# EAGLE design V2 (EAGLE 9.3.0)
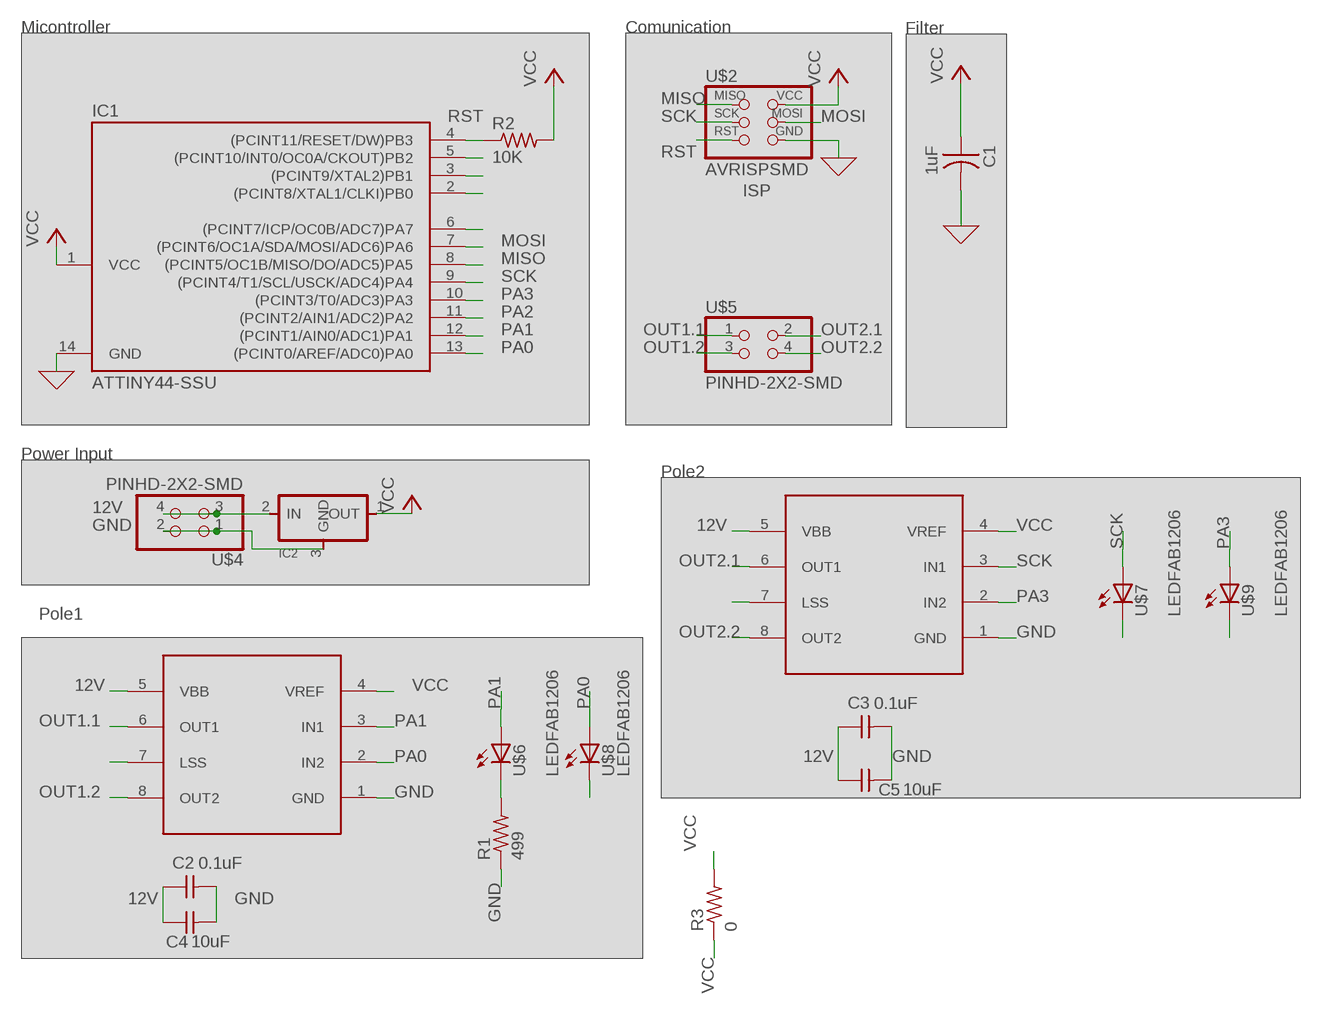
[diagram p0: schematic, sheet 1]

## Parts
C1  1uF  CAP-US1206FAB  [C1206FAB]
C2  0.1uF  CAP-UNPOLARIZEDFAB  [C1206FAB]
C3  0.1uF  CAP-UNPOLARIZEDFAB  [C1206FAB]
C4  10uF  CAP-UNPOLARIZEDFAB  [C1206FAB]
C5  10uF  CAP-UNPOLARIZEDFAB  [C1206FAB]
IC1  ATTINY44-SSU  [SOIC14]
IC2  REGULATORSOT23  [SOT23]
R1  499  RES-US1206FAB  [R1206FAB]
R2  10K  RES-US1206FAB  [R1206FAB]
R3  0  RES-US1206FAB  [R1206FAB]
U$1  A4953-H-BRIDGE-MOTOR-DRIVER  [SOIC8]
U$2  AVRISPSMD  [2X03SMD]
U$3  A4953-H-BRIDGE-MOTOR-DRIVER  [SOIC8]
U$4  PINHD-2X2-SMD  [2X02SMD]
U$5  PINHD-2X2-SMD  [2X02SMD]
U$6  LEDFAB1206  [LED1206FAB]
U$7  LEDFAB1206  [LED1206FAB]
U$8  LEDFAB1206  [LED1206FAB]
U$9  LEDFAB1206  [LED1206FAB]

## Nets
12V: C2.1 C3.1 C4.1 C5.1 IC2.2(IN) U$1.5(VBB) U$3.5(VBB) U$4.3 U$4.4
GND: C1.2 C2.2 C3.2 C4.2 C5.2 IC1.14(GND) IC2.3(GND) R1.1 U$1.1(GND) U$2.6(GND) U$3.1(GND) U$4.1 U$4.2
MISO: IC1.6((PCINT7/ICP/OC0B/ADC7)PA7) IC1.8((PCINT5/OC1B/MISO/DO/ADC5)PA5) U$2.1(MISO)
MOSI: IC1.7((PCINT6/OC1A/SDA/MOSI/ADC6)PA6) U$2.4(MOSI)
N$4: U$3.7(LSS)
N$5: IC1.5((PCINT10/INT0/OC0A/CKOUT)PB2)
N$6: IC1.3((PCINT9/XTAL2)PB1)
N$7: IC1.2((PCINT8/XTAL1/CLKI)PB0)
N$9: U$1.7(LSS)
OUT1.1: U$1.6(OUT1) U$5.1
OUT1.2: U$1.8(OUT2) U$5.3
OUT2.1: U$3.6(OUT1) U$5.2
OUT2.2: U$3.8(OUT2) U$5.4
PA0: IC1.13((PCINT0/AREF/ADC0)PA0) U$1.2(IN2) U$8.1(A)
PA1: IC1.12((PCINT1/AIN0/ADC1)PA1) U$1.3(IN1) U$6.1(A)
PA2: IC1.11((PCINT2/AIN1/ADC2)PA2)
PA3: IC1.10((PCINT3/T0/ADC3)PA3) U$3.2(IN2) U$9.1(A)
RES: R1.2 U$6.2(C) U$7.2(C) U$8.2(C) U$9.2(C)
RST: IC1.4((PCINT11/RESET/DW)PB3) R2.1 U$2.5(RST)
SCK: IC1.9((PCINT4/T1/SCL/USCK/ADC4)PA4) U$2.3(SCK) U$3.3(IN1) U$7.1(A)
VCC: C1.1 IC1.1(VCC) IC2.1(OUT) R2.2 R3.1 R3.2 U$1.4(VREF) U$2.2(VCC) U$3.4(VREF)

## Notes on the sheet
- Micontroller | Comunication | Filter
- ISP
- Power Input
- Pole2
- Pole1

## Library data of the parts
C1 = fab:CAP-US
C2-C5 = fab:CAP-UNPOLARIZED
IC1 = fab:ATTINY44
IC2 = fab:REGULATOR
R1-R3 = fab:RES-US: Resistor (US Symbol) Variants with postfix FAB are widened to allow the routing of internal traces
U$1 U$3 = fab:A4953-H-BRIDGE-MOTOR-DRIVER
U$2 = fab:AVRISP
U$4 U$5 = fab:PINHD-2X2-SMD
U$6-U$9 = fab:LED: LED

## Board
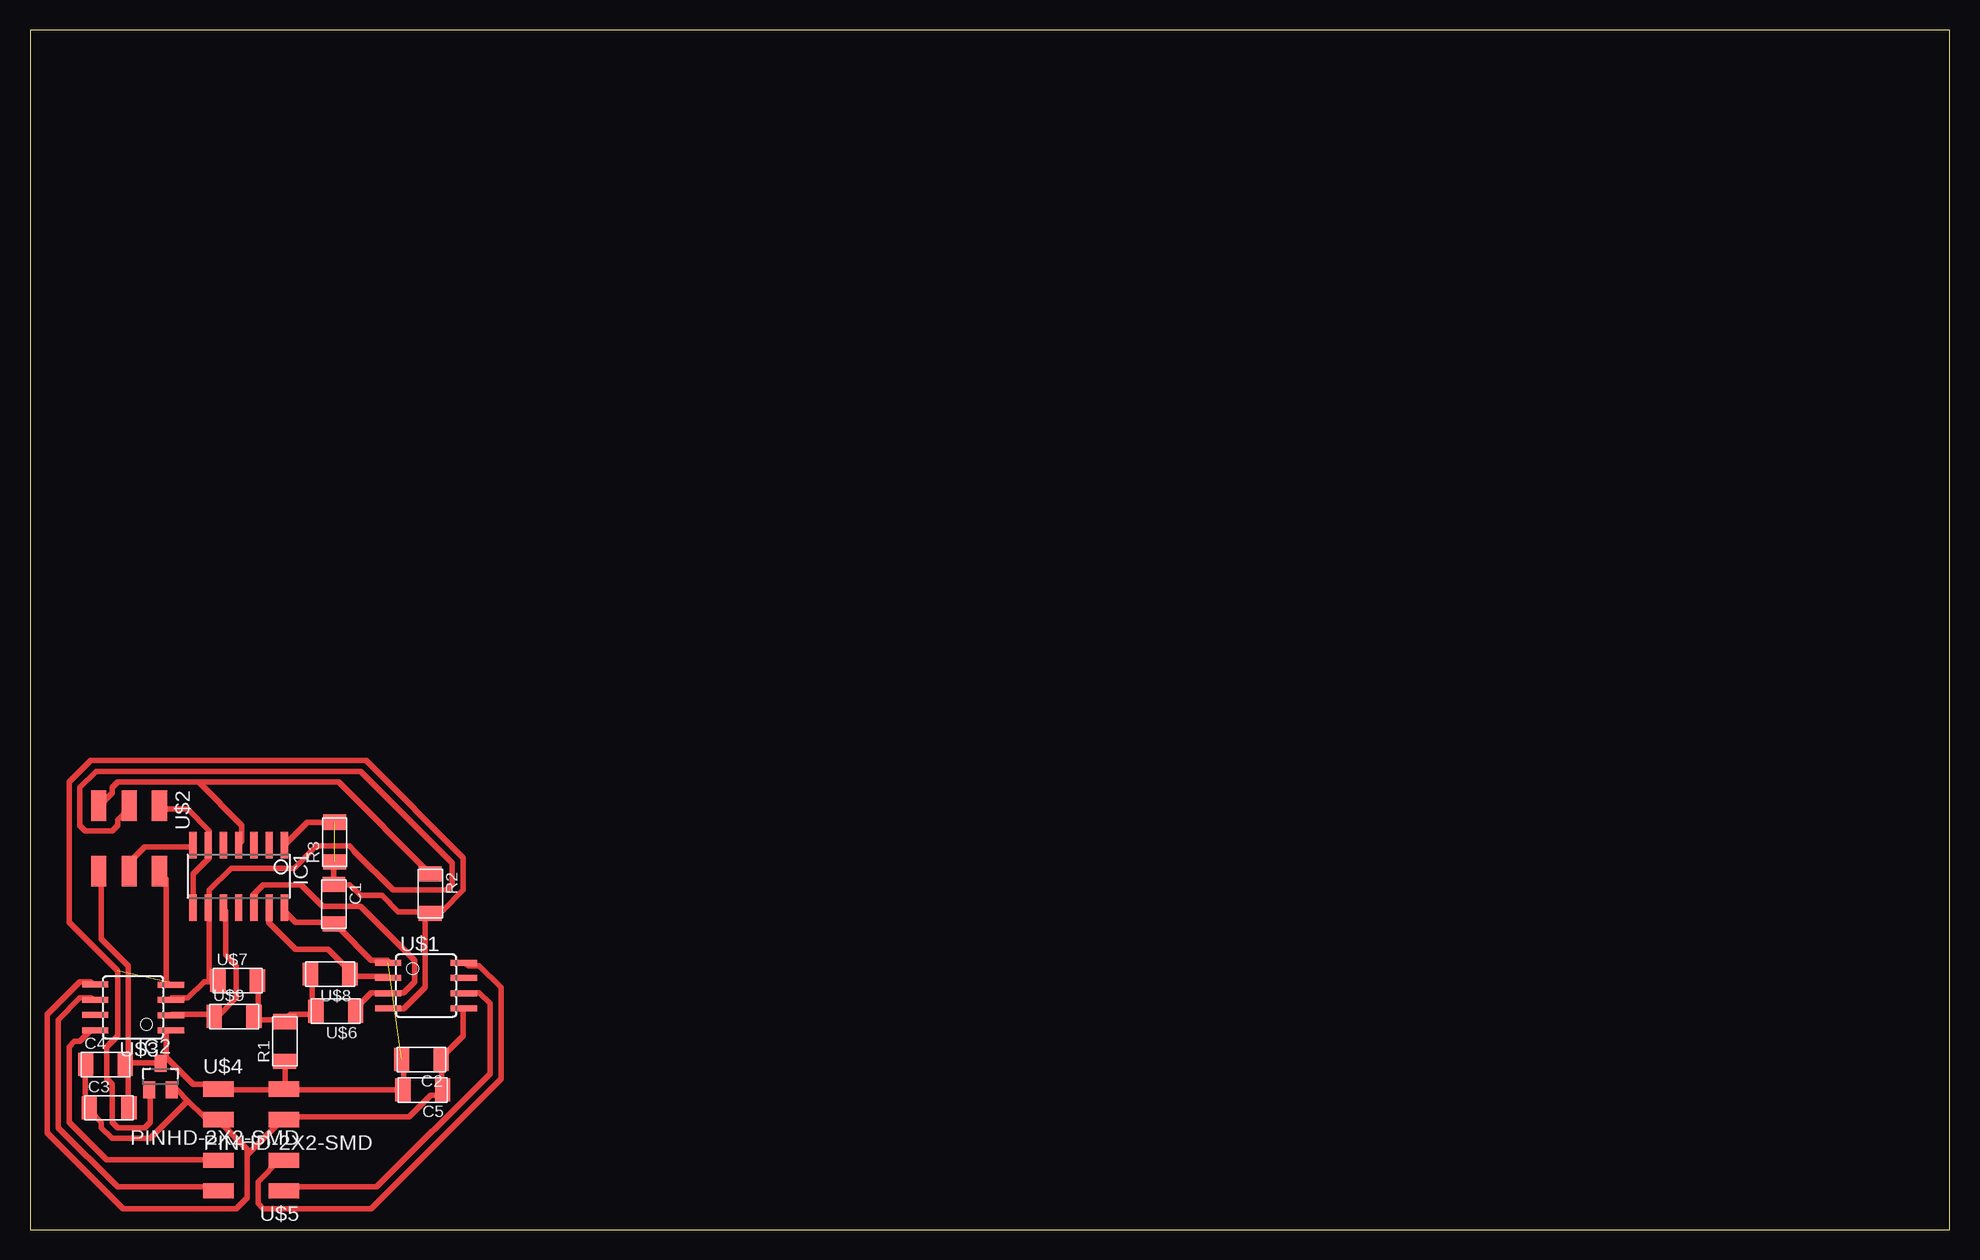
[diagram p1: board, top side]

Size 160 x 100 mm. Coordinates in mm from the lower left corner, seen from the top.
Outline: 0,0 160,0 160,100 0,100 0,0
Copper layers (1*16): Top 0.035mm / dielectric 1.5mm / Bottom 0.035mm
Design rules "default *": minimum track width 0.45mm, minimum drill 0.35mm, track to track 0.45mm, track to pad 0.45mm, pad to pad 0.45mm, via to via 0.45mm, smd to smd 0.45mm, copper to edge 40mil, drill to drill 6mil, minimum pad ring 10mil, minimum via ring 8mil, stop-mask expansion 4mil, vias tented up to drill 0mil, thermal gap 10mil

### Footprints (pad centres in the part's own frame; a part is rotated, then mirrored left to right if it is on the bottom)
C1206FAB = smd 1.27 x 1.905: 1 -1.651,0; 2 1.651,0
SOIC14 = smd 0.61 x 2.21: 1 -3.81,-2.603; 2 -2.54,-2.603; 3 -1.27,-2.603; 4 0,-2.603; 5 1.27,-2.603; 6 2.54,-2.603; 7 3.81,-2.603; 8 3.81,2.603; 9 2.54,2.603; 10 1.27,2.603; 11 0,2.603; 12 -1.27,2.603; 13 -2.54,2.603; 14 -3.81,2.603
SOT23 = smd 1 x 1.4: 1 -0.95,-1.1; 2 0.95,-1.1; 3 0,1.1
R1206FAB = smd 1.27 x 1.905: 1 -1.651,0; 2 1.651,0
SOIC8 = smd 0.5 x 2.2: 1 -1.905,-3.154; 2 -0.645,-3.154; 3 0.625,-3.154; 4 1.895,-3.154; 5 1.905,3.154; 6 0.635,3.154; 7 -0.635,3.154; 8 -1.905,3.154
2X03SMD = smd 2.54 x 1.27: 1 -2.54,2.54; 2 2.92,2.54; 3 -2.54,0; 4 2.92,0; 5 -2.54,-2.54; 6 2.92,-2.54
2X02SMD = smd 2.54 x 1.27: 1 -2.54,1.27; 2 2.92,1.27; 3 -2.54,-1.27; 4 2.92,-1.27
LED1206FAB = smd 1.27 x 1.905: 1 -1.651,0; 2 1.651,0

### Placement (x,y rotation side)
C1  25.33,27.12 270 top
C2  32.62,14.18 180 top
C3  6.59,10.15 0 top
C4  6.29,13.76 0 top
C5  32.74,11.64 180 top
IC1  17.4,29.45 180 top
IC2  10.88,12.75 0 top
R1  21.24,15.68 90 top
R2  33.36,28 270 top
R3  25.4,32.3 90 top
U$1  33.01,20.33 270 top
U$2  8.26,32.81 270 top
U$3  8.59,18.52 90 top
U$4  18.25,10.43 0 top
U$5  18.64,4.5 180 top
U$6  25.49,18.2 180 top
U$7  17.31,20.75 0 top
U$8  25.02,21.29 180 top
U$9  17.01,17.76 0 top

### Tracks (layer width: path | path; a pad name or v marks a point on that pad's centre or on a via)
12V
  Top 0.45: U$1.5 36.1,18.4 36.1,16.15 34.3,14.35 C2.1 34.3,13.9 34.3,11.65 C5.1 34.3,11.2 33.4,11.2 31.6,9.4 21.25,9.4 U$4.4 20.8,8.95 18.1,6.25 | C4.1 4.6,13.45 4.6,10.3 C3.1 5.05,9.85 5.95,8.95 5.95,8.5 6.85,7.6 10,7.6 13.15,10.75 | 13.15,10.75 14.5,9.4 15.4,9.4 U$4.3 15.85,8.95 18.1,6.7 18.1,6.25 | 13.15,10.75 12.25,11.65 IC2.2 | 18.1,6.25 18.1,2.65 17.2,1.75 7.75,1.75 1.45,8.05 1.45,17.95 4.15,20.65 5.05,20.65 U$3.5
GND  (1 unrouted)
  Top 0.45: C2.2 31.15,13.9 31.15,11.65 C5.2 30.7,11.65 21.25,11.65 U$4.2 | R1.1 21.25,13.9 21.25,12.1 U$4.2 | U$4.2 20.8,11.65 15.85,11.65 U$4.1 15.4,12.1 13.6,12.1 11.35,14.35 | 8.2,13.9 10.45,13.9 IC2.3 | C3.2 8.2,10.3 8.2,13.45 C4.2 8.2,13.9 | 11.35,14.35 11.35,16.6 U$3.1 | 11.35,14.35 10.9,13.9 IC2.3 | 8.2,13.9 8.2,22 5.95,24.25 5.95,29.65 U$2.6 | 11.35,14.35 IC2.3 | IC1.14 21.25,26.5 22.15,25.6 25.3,25.6 C1.2 25.75,25.15 28.45,22.45 29.8,22.45 U$1.1
MISO
  Top 0.45: IC1.8 13.6,26.95 13.6,29.65 14.95,31 14.95,31.9 IC1.6 14.95,32.35 14.95,33.25 13.15,35.05 10.9,35.05 U$2.1
MOSI
  Top 0.45: IC1.7 13.6,31.9 9.55,31.9 8.65,31 8.65,30.1 U$2.4
OUT1.1
  Top 0.45: U$1.6 36.55,19.75 37.45,19.75 38.35,18.85 38.35,13 28.9,3.55 21.25,3.55 U$5.1
OUT1.2
  Top 0.45: U$1.8 36.55,22 37.45,22 39.25,20.2 39.25,12.55 28.45,1.75 19.45,1.75 19,2.2 19,4 20.8,5.8 U$5.3
OUT2.1
  Top 0.45: U$3.6 5.05,19.3 4.15,19.3 2.35,17.5 2.35,8.5 7.3,3.55 15.4,3.55 U$5.2
OUT2.2
  Top 0.45: U$3.8 5.05,16.6 4.15,15.7 3.7,15.7 3.25,15.25 3.25,8.95 6.4,5.8 15.4,5.8 U$5.4
PA0
  Top 0.45: U$1.2 29.8,21.1 27.1,21.1 U$8.1 26.65,21.55 24.85,23.35 22.15,23.35 19.9,25.6 19.9,26.5 IC1.13
PA1
  Top 0.45: U$6.1 27.55,18.4 27.55,18.85 28.45,19.75 29.8,19.75 U$1.3 30.25,19.75 31.15,19.75 32.05,20.65 32.05,22.45 27.55,26.95 24.4,26.95 22.6,28.75 19.45,28.75 18.55,27.85 18.55,26.95 IC1.12
PA3
  Top 0.45: U$3.2 11.8,17.95 14.95,17.95 U$9.1 15.4,17.5 17.2,19.3 17.2,22 16.3,22.9 16.3,26.5 IC1.10
RES
  Top 0.45: U$8.2 23.5,21.1 23.5,18.4 U$6.2 23.5,17.95 21.7,17.95 21.25,17.5 R1.2 20.8,17.5 19,17.5 U$9.2 19,17.95 19,20.65 U$7.2
RST
  Top 0.45: 32.95,30.1 R2.1 25.71,37.3 14.05,37.3 | IC1.4 17.65,32.35 17.65,33.7 14.05,37.3 | 14.05,37.3 7.3,37.3 6.85,36.85 6.85,36.4 5.95,35.5 U$2.5
SCK
  Top 0.45: 14.95,20.65 14.5,20.65 13.15,19.3 11.8,19.3 U$3.3 | 14.95,20.65 15.4,20.65 U$7.1 | 14.95,20.65 14.95,26.5 IC1.9 14.95,26.95 14.95,28.3 16.75,30.1 22,30.1 23.86,31.96 26.63,31.96 27.03,31.56 27.03,31.52 30.25,28.3 34.75,28.3 35.2,28.75 35.2,30.55 27.55,38.2 5.5,38.2 4.15,36.85 4.15,33.7 4.6,33.25 6.85,33.25 7.3,33.7 7.3,34.15 8.2,35.05 U$2.3
VCC  (2 unrouted)
  Top 0.45: U$3.4 11.35,20.65 11.35,29.2 10.9,29.65 U$2.2 | IC2.1 10,11.65 10,8.95 9.55,8.5 7.3,8.5 6.85,8.95 6.85,12.1 6.4,12.55 6.4,15.25 7.3,16.15 7.3,21.55 3.25,25.6 3.25,37.3 5.05,39.1 28,39.1 36.1,31 36.1,28.3 34.3,26.5 33.4,26.5 R2.2 | R2.2 32.95,26.5 30.7,26.5 29.35,27.85 27.55,27.85 26.65,28.75 25.75,28.75 C1.1 25.33,30.58 R3.1 | U$1.4 30.25,18.4 31.15,18.4 32.95,20.2 32.95,26.05 R2.2 | R3.2 23.11,33.95 IC1.1